# Altium schematic sheet Nixie.SchDoc: IN-12 Nixie Clock
size A3; Author: Tomasz Watorowski; CompanyName: Mighty Devices; DocumentNumber: 1; Revision: 1.0; SheetNumber: 1; SheetTotal: 1
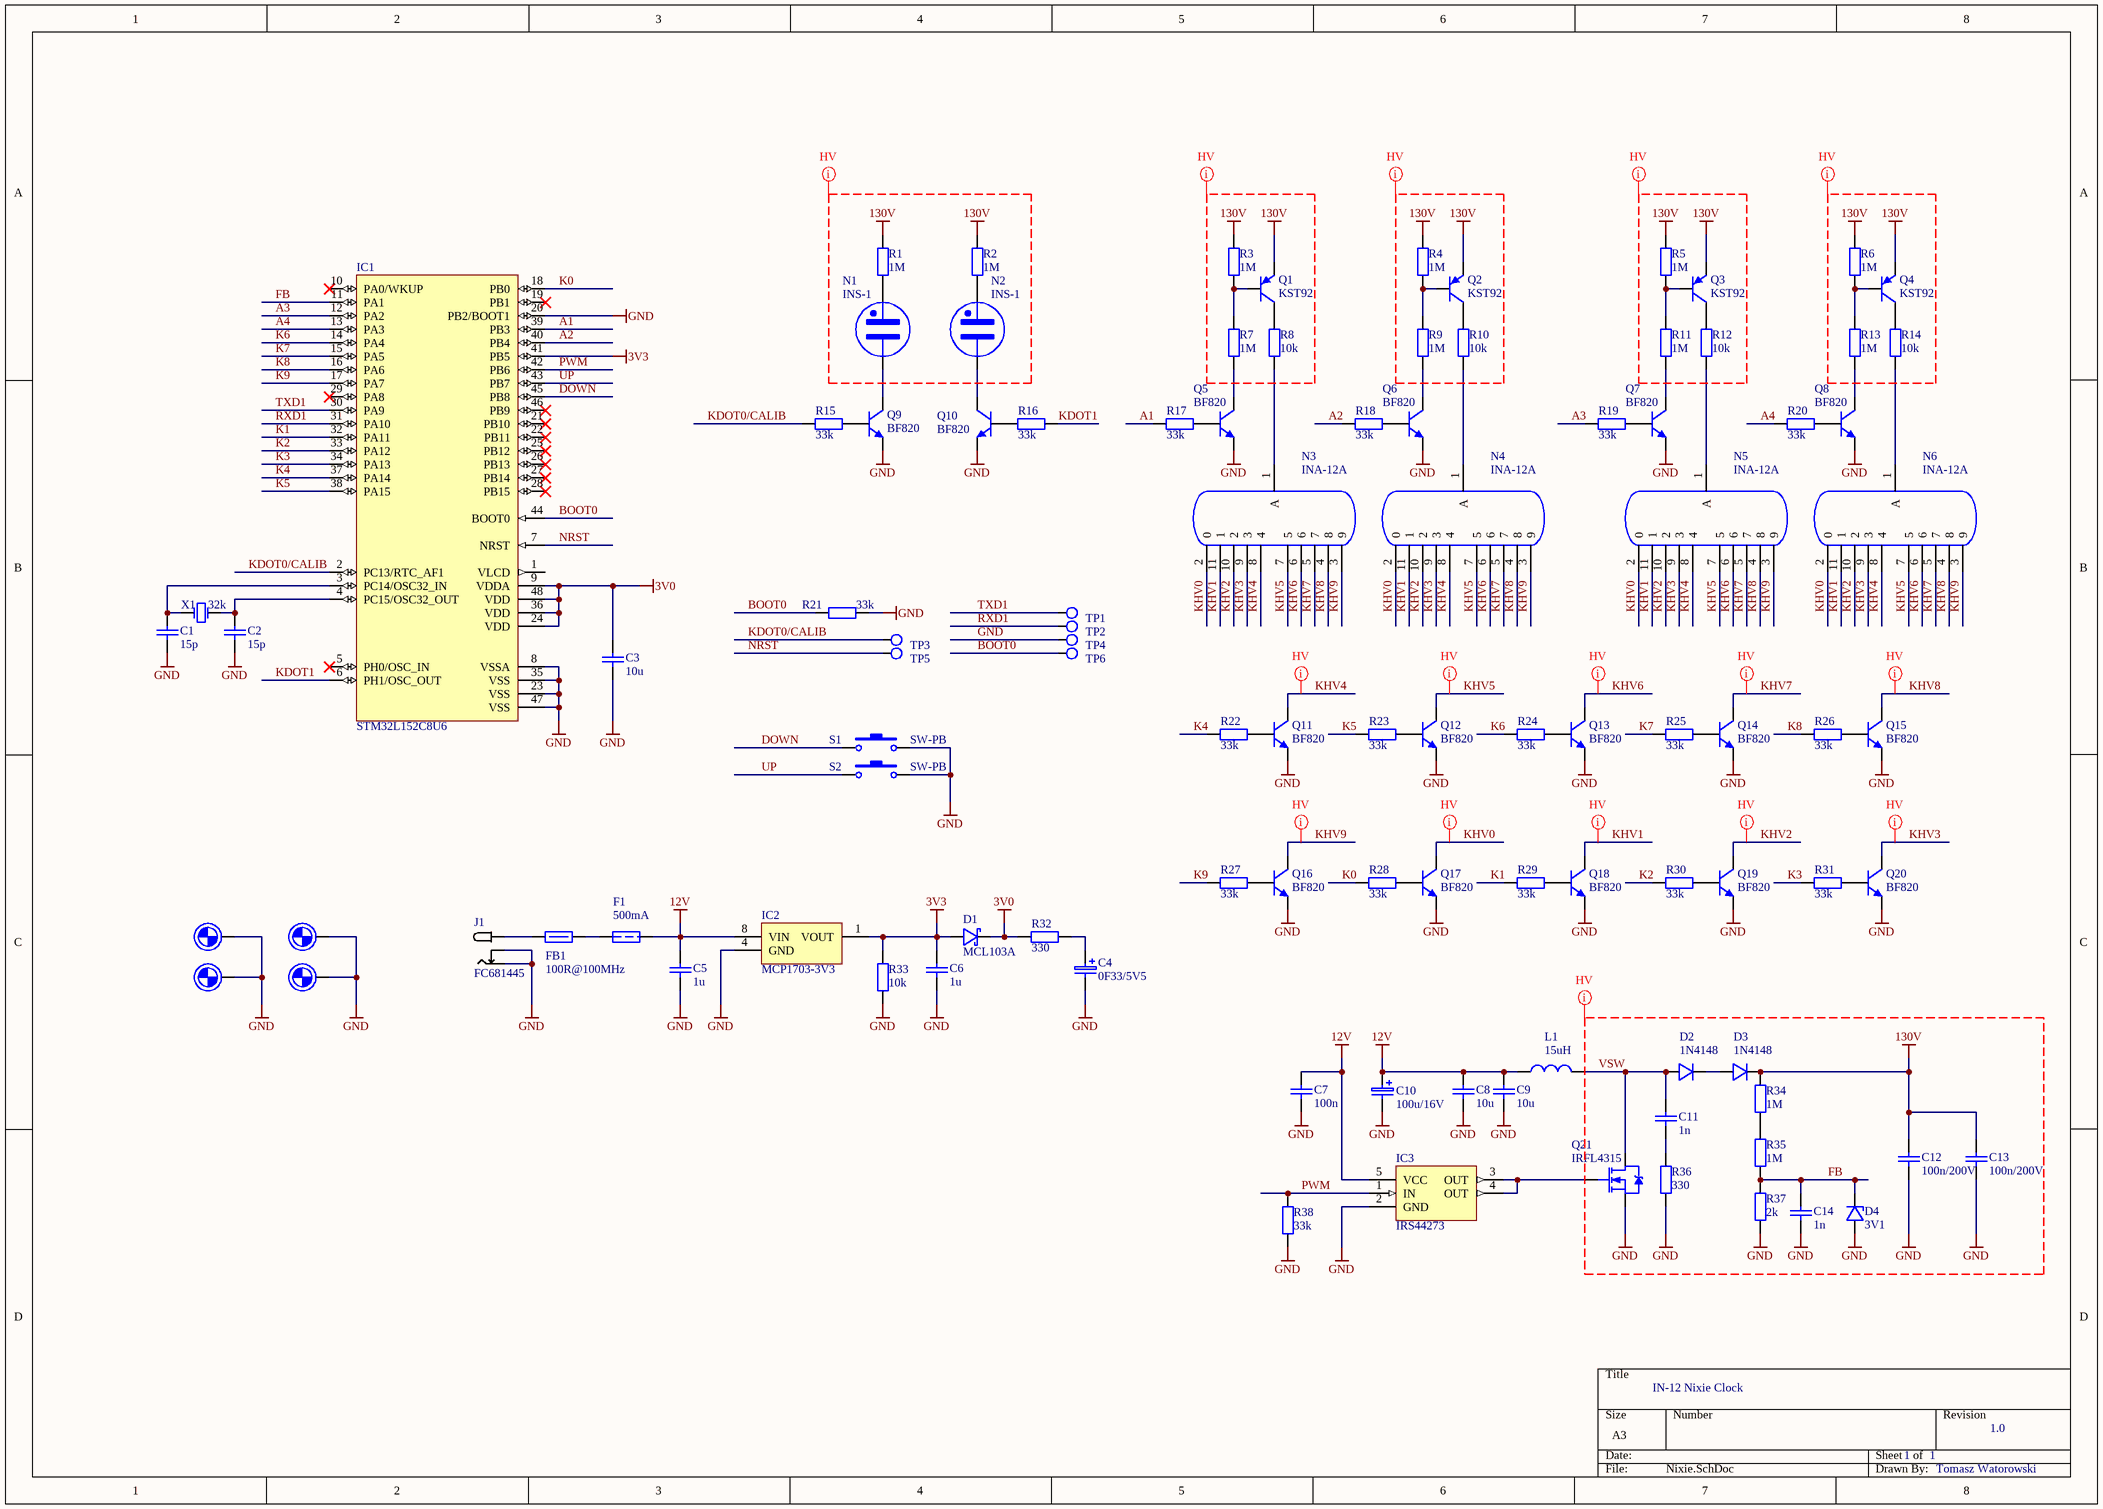
[diagram p0: Nixie.SchDoc]

## Parts
C1  15p  [0603_C]
C2  15p  [0603_C]
C3  10u  [0603_C]
C4  0F33/5V5  [CPOL_10x6.5]
C5  1u  [0603_C]
C6  1u  [0603_C]
C7  100n  [0603_C]
C8  10u  [1206_C]
C9  10u  [1206_C]
C10  100u/16V  [TAJ_C]
C11  1n  [0603_C]
C12  100n/200V  [1210_C]
C13  100n/200V  [1210_C]
C14  1n  [0603_C]
D1  MCL103A  [MICROMELF]
D2  1N4148  [0805_DSEMI]
D3  1N4148  [0805_DSEMI]
D4  3V1  [MICROMELF]
F1  500mA  [0805_PF]
FB1  100R@100MHz  [0805_FB]
IC1  STM32L152C8U6  [QFN48]
IC2  MCP1703-3V3  [SOT23-3L]
IC3  IRS44273  [SOT23-5AN]
J1  FC681445  [FC681445_TH]
L1  15uH  [DLG-0504]
MH1  Mouting Hole  [MH_M3]  (value not drawn)
MH2  Mouting Hole  [MH_M3]  (value not drawn)
MH3  Mouting Hole  [MH_M3]  (value not drawn)
MH4  Mouting Hole  [MH_M3]  (value not drawn)
N1  INS-1  [INS-1]
N2  INS-1  [INS-1]
N3  INA-12A  [IN-12]
N4  INA-12A  [IN-12]
N5  INA-12A  [IN-12]
N6  INA-12A  [IN-12]
Q1  KST92  [SOT23-3L]
Q2  KST92  [SOT23-3L]
Q3  KST92  [SOT23-3L]
Q4  KST92  [SOT23-3L]
Q5  BF820  [SOT23-3L]
Q6  BF820  [SOT23-3L]
Q7  BF820  [SOT23-3L]
Q8  BF820  [SOT23-3L]
Q9  BF820  [SOT23-3L]
Q10  BF820  [SOT23-3L]
Q11  BF820  [SOT23-3L]
Q12  BF820  [SOT23-3L]
Q13  BF820  [SOT23-3L]
Q14  BF820  [SOT23-3L]
Q15  BF820  [SOT23-3L]
Q16  BF820  [SOT23-3L]
Q17  BF820  [SOT23-3L]
Q18  BF820  [SOT23-3L]
Q19  BF820  [SOT23-3L]
Q20  BF820  [SOT23-3L]
Q21  IRFL4315  [SOT-223_Connected]
R1  1M  [0805_R]
R2  1M  [0805_R]
R3  1M  [0805_R]
R4  1M  [0805_R]
R5  1M  [0805_R]
R6  1M  [0805_R]
R7  1M  [0805_R]
R8  10k  [0805_R]
R9  1M  [0805_R]
R10  10k  [0805_R]
R11  1M  [0805_R]
R12  10k  [0805_R]
R13  1M  [0805_R]
R14  10k  [0805_R]
R15  33k  [0603_R]
R16  33k  [0603_R]
R17  33k  [0603_R]
R18  33k  [0603_R]
R19  33k  [0603_R]
R20  33k  [0603_R]
R21  33k  [0603_R]
R22  33k  [0603_R]
R23  33k  [0603_R]
R24  33k  [0603_R]
R25  33k  [0603_R]
R26  33k  [0603_R]
R27  33k  [0603_R]
R28  33k  [0603_R]
R29  33k  [0603_R]
R30  33k  [0603_R]
R31  33k  [0603_R]
R32  330  [0603_R]
R33  10k  [0603_R]
R34  1M  [0805_R]
R35  1M  [0805_R]
R36  330  [0805_R]
R37  2k  [0603_R]
R38  33k  [0603_R]
S1  SW-PB  [DTSM32N]
S2  SW-PB  [DTSM32N]
TP1  Test Point  [TP_1_5]  (value not drawn)
TP2  Test Point  [TP_1_5]  (value not drawn)
TP3  Test Point  [TP_1_5]  (value not drawn)
TP4  Test Point  [TP_1_5]  (value not drawn)
TP5  Test Point  [TP_1_5]  (value not drawn)
TP6  Test Point  [TP_1_5]  (value not drawn)
X1  32k  [CFPX–217]

## Nets
3V0: C3.2 D1.2(K) IC1.9(VDDA) IC1.24(VDD) IC1.36(VDD) IC1.48(VDD) R32.1
3V3: C6.2 D1.1(A) IC1.41(PB5) IC2.1(VOUT) R33.2
12V: C5.2 C7.2 C8.2 C9.2 C10.1 F1.2 IC2.8(VIN) IC3.5(VCC) L1.1
130V: C12.2 C13.2 D3.2(K) Q1.2(E) Q2.2(E) Q3.2(E) Q4.2(E) R1.2 R2.2 R3.1 R4.1 R5.1 R6.1 R34.2
GND: C1.1 C2.1 C3.1 C4.2 C5.1 C6.1 C7.1 C8.1 C9.1 C10.2 C12.1 C13.1 C14.1 D4.1(A) IC1.8(VSSA) IC1.20(PB2/BOOT1) IC1.23(VSS) IC1.35(VSS) IC1.47(VSS) IC2.4(GND) IC3.2(GND) J1.2 J1.3 MH1.1 MH2.1 MH3.1 MH4.1 Q5.2(E) Q6.2(E) Q7.2(E) Q8.2(E) Q9.2(E) Q10.2(E) Q11.2(E) Q12.2(E) Q13.2(E) Q14.2(E) Q15.2(E) Q16.2(E) Q17.2(E) Q18.2(E) Q19.2(E) Q20.2(E) Q21.3(S) R21.2 R33.1 R36.1 R37.2 R38.2 S1.2 S2.2 TP4.1(GND)
A1: IC1.39(PB3) R17.2
A2: IC1.40(PB4) R18.2
A3: IC1.12(PA2) R19.2
A4: IC1.13(PA3) R20.2
BOOT0: IC1.44(BOOT0) R21.1 TP6.1(GND)
DOWN: IC1.45(PB8) S1.1
FB: C14.2 D4.2(K) IC1.11(PA1) R35.1 R37.1
K0: IC1.18(PB0) R28.2
K1: IC1.32(PA11) R29.2
K2: IC1.33(PA12) R30.2
K3: IC1.34(PA13) R31.2
K4: IC1.37(PA14) R22.2
K5: IC1.38(PA15) R23.2
K6: IC1.14(PA4) R24.2
K7: IC1.15(PA5) R25.2
K8: IC1.16(PA6) R26.2
K9: IC1.17(PA7) R27.2
KDOT0/CALIB: IC1.2(PC13/RTC_AF1) R15.2 TP3.1(GND)
KDOT1: IC1.6(PH1/OSC_OUT) R16.2
KHV0: N3.2(0) N4.2(0) N5.2(0) N6.2(0) Q17.3(C)
KHV1: N3.11(1) N4.11(1) N5.11(1) N6.11(1) Q18.3(C)
KHV2: N3.10(2) N4.10(2) N5.10(2) N6.10(2) Q19.3(C)
KHV3: N3.9(3) N4.9(3) N5.9(3) N6.9(3) Q20.3(C)
KHV4: N3.8(4) N4.8(4) N5.8(4) N6.8(4) Q11.3(C)
KHV5: N3.7(5) N4.7(5) N5.7(5) N6.7(5) Q12.3(C)
KHV6: N3.6 N4.6 N5.6 N6.6 Q13.3(C)
KHV7: N3.5(7) N4.5(7) N5.5(7) N6.5(7) Q14.3(C)
KHV8: N3.4(8) N4.4(8) N5.4(8) N6.4(8) Q15.3(C)
KHV9: N3.3(9) N4.3(9) N5.3(9) N6.3(9) Q16.3(C)
NRST: IC1.7(NRST) TP5.1(GND)
PWM: IC1.42(PB6) IC3.1(IN) R38.1
RXD1: IC1.31(PA10) TP2.1(GND)
TXD1: IC1.30(PA9) TP1.1(GND)
UP: IC1.43(PB7) S2.1
VSW: C11.2 D2.1(A) L1.2 Q21.2(D)
NetC1_2: C1.2 IC1.3(PC14/OSC32_IN) X1.2(OSC2)
NetC2_2: C2.2 IC1.4(PC15/OSC32_OUT) X1.1(OSC1)
NetC4_1: C4.1 R32.2
NetC11_1: C11.1 R36.2
NetD2_2: D2.2(K) D3.1(A)
NetF1_1: F1.1 FB1.2
NetFB1_1: FB1.1 J1.1
NetIC3_3: IC3.3(OUT) IC3.4(OUT) Q21.1(G)
NetN1_1: N1.1 R1.1
NetN1_2: N1.2 Q9.3(C)
NetN2_1: N2.1 R2.1
NetN2_2: N2.2 Q10.3(C)
NetN3_1: N3.1(A) R8.1
NetN4_1: N4.1(A) R10.1
NetN5_1: N5.1(A) R12.1
NetN6_1: N6.1(A) R14.1
NetQ1_1: Q1.1(B) R3.2 R7.1
NetQ1_3: Q1.3(C) R8.2
NetQ2_1: Q2.1(B) R4.2 R9.1
NetQ2_3: Q2.3(C) R10.2
NetQ3_1: Q3.1(B) R5.2 R11.1
NetQ3_3: Q3.3(C) R12.2
NetQ4_1: Q4.1(B) R6.2 R13.1
NetQ4_3: Q4.3(C) R14.2
NetQ5_1: Q5.1(B) R17.1
NetQ5_3: Q5.3(C) R7.2
NetQ6_1: Q6.1(B) R18.1
NetQ6_3: Q6.3(C) R9.2
NetQ7_1: Q7.1(B) R19.1
NetQ7_3: Q7.3(C) R11.2
NetQ8_1: Q8.1(B) R20.1
NetQ8_3: Q8.3(C) R13.2
NetQ9_1: Q9.1(B) R15.1
NetQ10_1: Q10.1(B) R16.1
NetQ11_1: Q11.1(B) R22.1
NetQ12_1: Q12.1(B) R23.1
NetQ13_1: Q13.1(B) R24.1
NetQ14_1: Q14.1(B) R25.1
NetQ15_1: Q15.1(B) R26.1
NetQ16_1: Q16.1(B) R27.1
NetQ17_1: Q17.1(B) R28.1
NetQ18_1: Q18.1(B) R29.1
NetQ19_1: Q19.1(B) R30.1
NetQ20_1: Q20.1(B) R31.1
NetR34_1: R34.1 R35.2

Not connected (* = marked no-connect by the designer): IC1 1(VLCD) 5(PH0/OSC_IN)* 10(PA0/WKUP)* 19(PB1)* 21(PB10)* 22(PB11)* 25(PB12)* 26(PB13)* 27(PB14)* 28(PB15)* 29(PA8)* 46(PB9)*

## Layout directives
net class HV: 130V, FB, GND, KHV0, KHV1, KHV2, KHV3, KHV4, KHV5, KHV6, KHV7, KHV8, KHV9, VSW

## Library data of the parts
C1-C3 C5-C9 C11-C14 = Capacitor (Non Polar): Capacitor; Value: 100pF; Published: 8-Jun-2000; LatestRevisionDate: 29-May-2009; LatestRevisionNote: IPC-7351 Footprint Added.; PackageReference: C1206; Publisher: Altium Limited; PackageDescription: Chip Capacitor
C4 C10 = Capacitor (Electrolytic): Capacitor
D1 = Diode Schottky: Silicon Diode; Published: 8-Jun-2000; LatestRevisionDate: 17-Jul-2002; LatestRevisionNote: Re-released for DXP Platform.; DatasheetVersion: 1998; PackageVersion: Aug-1999; PackageReference: DO-41; Publisher: Altium Limited; Code_JEDEC: DO-204-AL; ComponentLink1Description: Manufacturer Link; ComponentLink1URL: http://www.fairchildsemi.com/; ComponentLink2Description: Datasheet; ComponentLink2URL: http://www.fairchildsemi.com/ds/1N%2F1N4001.pdf
D2 D3 = Diode: Silicon Diode; Published: 8-Jun-2000; LatestRevisionDate: 17-Jul-2002; LatestRevisionNote: Re-released for DXP Platform.; DatasheetVersion: 1998; PackageVersion: Aug-1999; PackageReference: DO-41; Publisher: Altium Limited; Code_JEDEC: DO-204-AL; ComponentLink1Description: Manufacturer Link; ComponentLink1URL: http://www.fairchildsemi.com/; ComponentLink2Description: Datasheet; ComponentLink2URL: http://www.fairchildsemi.com/ds/1N%2F1N4001.pdf
D4 = Diode Zener: Silicon Zener Diode; Published: 8-Jun-2000; LatestRevisionDate: 17-Jul-2002; LatestRevisionNote: Re-released for DXP Platform.; DatasheetVersion: 1998; PackageVersion: Aug-1999; PackageReference: DO-41; Publisher: Altium Limited; Code_JEDEC: DO-204-AL; ComponentLink1Description: Manufacturer Link; ComponentLink1URL: http://www.fairchildsemi.com/; ComponentLink2Description: Datasheet; ComponentLink2URL: http://www.fairchildsemi.com/ds/1N%2F1N4001.pdf
F1 = Fuse: Polymer Fuse; Published: 8-Jun-2000; LatestRevisionDate: 29-May-2009; LatestRevisionNote: IPC-7351 Footprint Added.; PackageReference: C1206; Publisher: Altium Limited; PackageDescription: Chip Capacitor
FB1 = Ferrite Bead
IC1 = STM32L152C6U6: Cortex-M3 MCU; ClassName: ICs
IC2 = MCP1703: 250 mA, 16V, Low Quiescent Current LDO Regulator; pin to pad: 1>2 4>1 8>3
IC3 = IRS44273: Single Low-Side Driver IC
J1 = FC681445: DC Connector
L1 = INDUCTOR
N1 N2 = INS-1: Neon Bulb
N3-N6 = IN-12A: Nixie Tube
Q5-Q20 = BF820: NPN high-voltage transistor
Q21 = IRFL4315: HEXFET Power MOSFET
R1-R38 = Resistor: Published: 8-Jun-2000; LatestRevisionDate: 29-May-2009; LatestRevisionNote: IPC-7351 Footprint Added.; PackageReference: C1206; Publisher: Altium Limited; PackageDescription: Chip Capacitor
S1 S2 = SW-PB: Switch; Published: 24-Mar-1999; LatestRevisionDate: 17-Jul-2002; LatestRevisionNote: Re-released for DXP Platform.; PackageReference: SPST-2; Publisher: Altium Limited
X1 = Crystal: Crystal Resonator